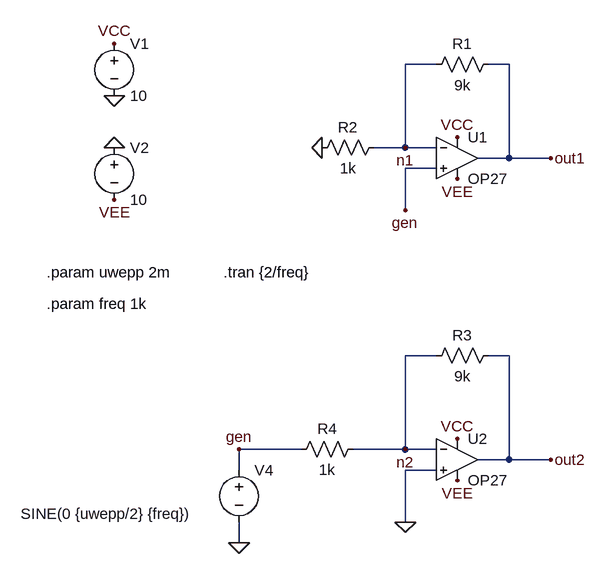
[diagram p0: schematic cw10_pt_opamp.asc]
cw10_pt_opamp.asc, the LTspice schematic file:
Version 4
SHEET 1 880 1240
WIRE 96 -16 48 -16
WIRE 208 -16 176 -16
WIRE 48 112 48 -16
WIRE 48 112 0 112
WIRE 96 112 48 112
WIRE 208 128 208 -16
WIRE 208 128 160 128
WIRE 272 128 208 128
WIRE 96 144 48 144
WIRE 48 208 48 144
WIRE 96 432 48 432
WIRE 208 432 176 432
WIRE -112 576 -208 576
WIRE 48 576 48 432
WIRE 48 576 -32 576
WIRE 96 576 48 576
WIRE 208 592 208 432
WIRE 208 592 160 592
WIRE 272 592 208 592
WIRE -208 608 -208 576
WIRE 96 608 48 608
WIRE 48 688 48 608
WIRE -208 720 -208 688
FLAG -400 32 0
FLAG -400 112 0
FLAG -400 -48 VCC
FLAG -400 192 VEE
FLAG 128 624 VEE
FLAG 128 160 VEE
FLAG 128 96 VCC
FLAG 128 560 VCC
FLAG -80 112 0
FLAG -208 720 0
FLAG 48 688 0
FLAG 272 128 out1
FLAG 272 592 out2
FLAG -208 576 gen
FLAG 48 208 gen
FLAG 48 112 n1
FLAG 48 576 n2
SYMBOL OpAmps\\OP27 128 64 R0
SYMATTR InstName U1
SYMBOL OpAmps\\OP27 128 528 R0
SYMATTR InstName U2
SYMBOL voltage -400 -64 R0
WINDOW 123 0 0 Left 0
WINDOW 39 0 0 Left 0
SYMATTR InstName V1
SYMATTR Value 10
SYMBOL voltage -400 96 R0
WINDOW 123 0 0 Left 0
WINDOW 39 0 0 Left 0
SYMATTR InstName V2
SYMATTR Value 10
SYMBOL res 192 -32 R90
WINDOW 0 0 56 VBottom 2
WINDOW 3 32 56 VTop 2
SYMATTR InstName R1
SYMATTR Value 9k
SYMBOL res 16 96 R90
WINDOW 0 0 56 VBottom 2
WINDOW 3 32 56 VTop 2
SYMATTR InstName R2
SYMATTR Value 1k
SYMBOL res 192 416 R90
WINDOW 0 0 56 VBottom 2
WINDOW 3 32 56 VTop 2
SYMATTR InstName R3
SYMATTR Value 9k
SYMBOL res -16 560 R90
WINDOW 0 0 56 VBottom 2
WINDOW 3 32 56 VTop 2
SYMATTR InstName R4
SYMATTR Value 1k
SYMBOL voltage -208 592 R0
WINDOW 3 -336 83 Left 2
WINDOW 123 0 0 Left 0
WINDOW 39 0 0 Left 0
SYMATTR Value SINE(0 {uwepp/2} {freq})
SYMATTR InstName V4
TEXT -504 304 Left 2 !.param uwepp 2m
TEXT -504 352 Left 2 !.param freq 1k
TEXT -232 304 Left 2 !.tran {2/freq}

The netlist it stands for:
* cw10_pt_opamp.asc
XU1 gen n1 VCC VEE out1 OP27  ; pins In+ In- V+ V- OUT
XU2 0 n2 VCC VEE out2 OP27  ; pins In+ In- V+ V- OUT
V1 VCC 0 10
V2 0 VEE 10
R1 out1 n1 9k
R2 n1 0 1k
R3 out2 n2 9k
R4 n2 gen 1k
V4 gen 0 SINE(0 {uwepp/2} {freq})
.param uwepp 2m
.param freq 1k
.tran {2/freq}
.lib ADI.lib
.backanno
.end